# EAGLE design Shunt_Amp_Meter (EAGLE 9.4.2)
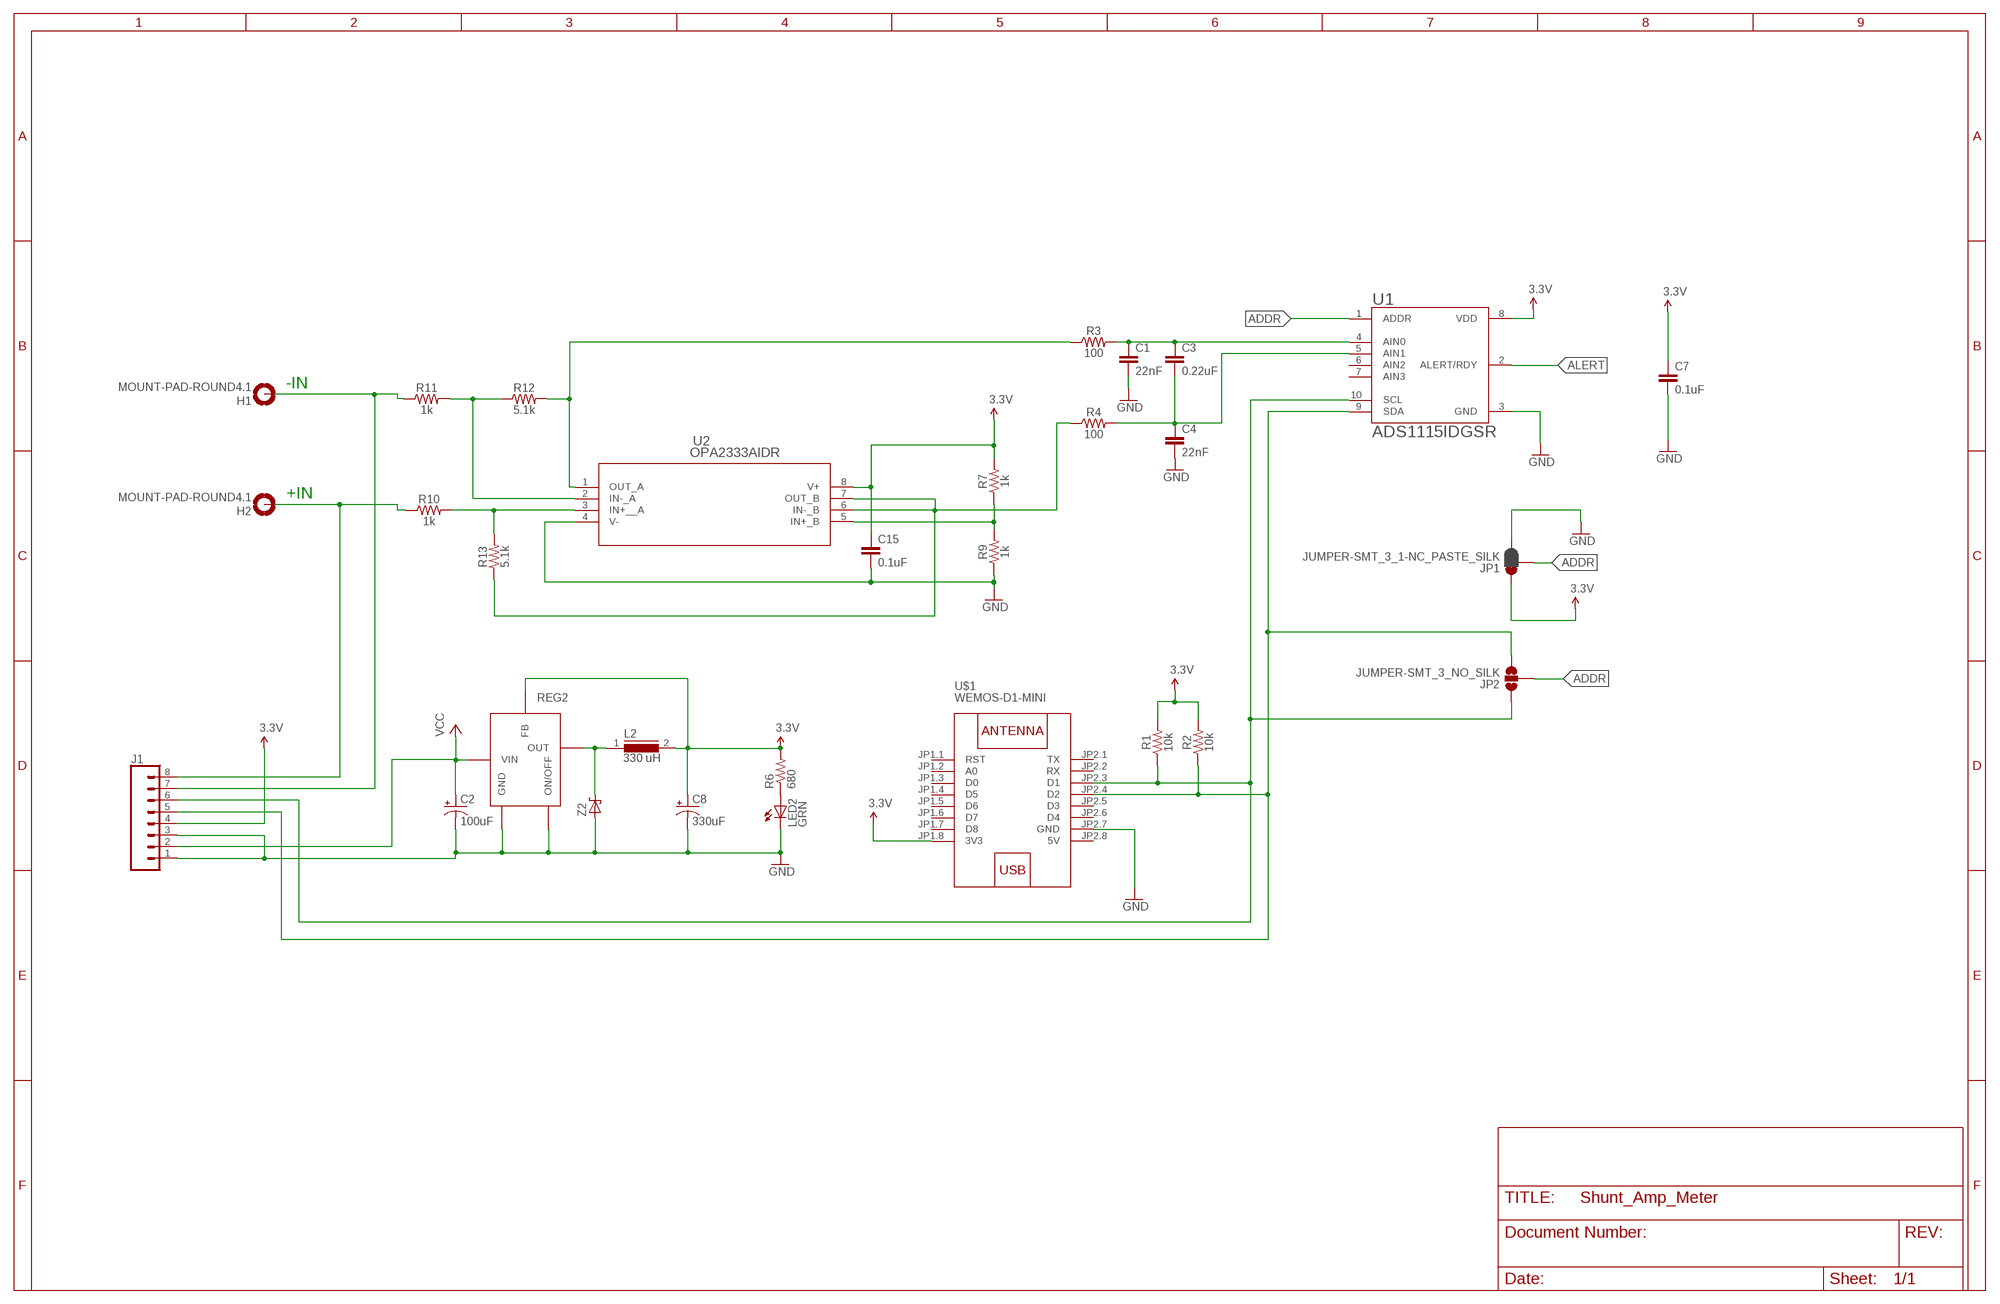
[diagram p0: schematic, sheet 1]

## Parts
C1  22nF  22NF/22,000PF-0603-50V-10%  [0603]
C2  100uF  CAP_POLF  [F_CAP]
C3  0.22uF  0.22UF-0603-25V-10%  [0603]
C4  22nF  22NF/22,000PF-0603-50V-10%  [0603]
C7  0.1uF  0.1UF-0603-25V-5%  [0603]
C8  330uF  CAP_POLF  [F_CAP]
C15  0.1uF  0.1UF-0603-25V-(+80/-20%)  [0603]
H1  MOUNT-PAD-ROUND4.1  [4,1-PAD]
H2  MOUNT-PAD-ROUND4.1  [4,1-PAD]
J1  CONN_08"  [1X08]
JP1  JUMPER-SMT_3_1-NC_PASTE_SILK  [SMT-JUMPER_3_1-NC_PASTE_SILK]
JP2  JUMPER-SMT_3_NO_SILK  [SMT-JUMPER_3_NO_SILK]
L2  330 uH  DR125  [DR125]
LED2  GRN  LED0603  [0603_LED]
R1  10k  10KOHM-0603-1/10W-1%  [0603]
R2  10k  10KOHM-0603-1/10W-1%  [0603]
R3  100  100OHM-0603-1/4W-5%  [0603]
R4  100  100OHM-0603-1/4W-5%  [0603]
R6  680  RESISTOR0603  [0603_RESISTOR]
R7  1k  1KOHM-0603-1/10W-1%  [0603]
R9  1k  1KOHM-0603-1/10W-1%  [0603]
R10  1k  1KOHM-0603-1/10W-1%  [0603]
R11  1k  1KOHM-0603-1/10W-1%  [0603]
R12  5.1k  RESISTOR0603  [0603]
R13  5.1k  RESISTOR0603  [0603]
REG2  TL2575  [TO-263-6]
U1  ADS1115IDGSR  [SOP50P490X110-10N]
U2  OPA2333AIDR  [D8]
U$1  WEMOS-D1-MINI  [WEMOS-D1-MINI]
Z2  SCHOTTKY_DIODE  [SMD_DIODE]

## Nets
3.3V: C7.1 C8.+ C15.1 J1.4 JP1.1 L2.2 R1.2 R2.2 R6.2 R7.2 REG2.4(FB) U1.8(VDD) U2.8(V+) U$1.JP1.8(3V3)
ADDR: JP1.2 JP2.2 U1.1(ADDR)
ALERT: U1.2(ALERT/RDY)
GND: C1.2 C2.- C4.2 C7.2 C8.- C15.2 J1.1 J1.3 JP1.3 LED2.C R9.1 REG2.3(GND) REG2.5(ON/OFF) U1.3(GND) U2.4(V-) U$1.JP2.7(GND) Z2.A
N$1: C1.1 C3.1 R3.2 U1.4(AIN0)
N$2: C3.2 C4.1 R4.2 U1.5(AIN1)
N$3: J1.6 JP2.1 R1.1 U1.10(SCL) U$1.JP2.3(D1)
N$4: J1.5 JP2.3 R2.1 U1.9(SDA) U$1.JP2.4(D2)
N$5: H1.B4,1(MOUNT) J1.7 R11.1
N$7: H2.B4,1(MOUNT) J1.8 R10.1
N$10: R7.1 R9.2 U2.5(IN+_B)
N$11: L2.1 REG2.2(OUT) Z2.C
N$12: LED2.A R6.1
N$13: R10.2 R13.2 U2.3(IN+__A)
N$14: R4.1 R13.1 U2.6(IN-_B) U2.7(OUT_B)
N$16: R11.2 R12.1 U2.2(IN-_A)
N$17: R3.1 R12.2 U2.1(OUT_A)
VCC: C2.+ J1.2 REG2.1(VIN)
Unconnected: U1.6(AIN2) U1.7(AIN3) U$1.JP1.1(RST) U$1.JP1.2(A0) U$1.JP1.3(D0) U$1.JP1.4(D5) U$1.JP1.5(D6) U$1.JP1.6(D7) U$1.JP1.7(D8) U$1.JP2.1(TX) U$1.JP2.2(RX) U$1.JP2.5(D3) U$1.JP2.6(D4)

## Notes on the sheet
- -IN
- +IN

## Power pins joined to a net without a drawn wire
5V: U$1.JP2.8(5V)

## Library data of the parts
C1 C4 = SparkFun-Capacitors:22NF/22,000PF: 0.022uF/22nF/22,000pF ceramic capacitors A capacitor is a passive two-terminal electrical component used to store electrical energy temporarily in an electric field.; PROD_ID: CAP-07885
C2 = jkf:CAP_POL; DIGIKEY#: PCE3917CT-ND
C3 = SparkFun-Capacitors:0.22UF: 0.22µF ceramic capacitors A capacitor is a passive two-terminal electrical component used to store electrical energy temporarily in an electric field.; PROD_ID: CAP-07822
C7 = SparkFun-Capacitors:0.1UF: 0.1µF ceramic capacitors A capacitor is a passive two-terminal electrical component used to store electrical energy temporarily in an electric field.; PROD_ID: CAP-08604
C8 = jkf:CAP_POL; DIGIKEY#: PCE3401CT-ND
C15 = SparkFun-Capacitors:0.1UF: 0.1µF ceramic capacitors A capacitor is a passive two-terminal electrical component used to store electrical energy temporarily in an electric field.; PROD_ID: CAP-00810
H1 H2 = holes:MOUNT-PAD-ROUND: MOUNTING PAD, round
J1 = SparkFun-Connectors:CONN_08: Multi connection point. Often used as Generic Header-pin footprint for 0.1 inch spaced/style header connections On any of the 0.1 inch spaced packages, you can populate with these: Break Away Headers - Straight <https://www.sparkfun.com/products/116> (PRT-00116) Break Away Male Headers - Right Angle <https://www.sparkfun.com/products/553> (PRT-00553) Female Headers <https://www.sparkfun.com/products/115> (PRT-00115) Break Away Headers - Machine Pin <https://www.sparkfun.com/products/117> (PRT-00117) Break Away Female Headers - Swiss Machine Pin <https://www.sparkfun.com/products/743> (PRT-00743) Arduino Stackable Header - 8 Pin <https://www.sparkfun.com/products/9279> (PRT-09279) For SCREWTERMINALS and SPRING TERMINALS visit here: Screw Terimnals on SparkFun.com <https://www.sparkfun.com/search/results?term=Screw+Terminals> (5mm/3.5mm/2.54mm spacing) This device is also useful as a general connection point to wire up your design to another part of your project. Our various solder wires solder well into these plated through hole pads. Hook-Up Wire - Assortment (Stranded, 22 AWG) <https://www.sparkfun.com/products/11375> (PRT-11375) Hook-Up Wire - Assortment (Solid Core, 22 AWG) <https://www.sparkfun.com/products/11367> (PRT-11367) View the entire wire category on our website here <https://www.sparkfun.com/categories/141> Special notes: Molex polarized connector foot print use with SKU : PRT-08231 with associated crimp pins and housings. 1MM SMD Version SKU: PRT-10208 NOTES ON THE VARIANTS LOCK and LOCK_LONGPADS... This footprint was designed to help hold the alignment of a through-hole component (i.e. 6-pin header) while soldering it into place. You may notice that each hole has been shifted either up or down by 0.005 of an inch from it's more standard position (which is a perfectly straight line). This slight alteration caused the pins (the squares in the middle) to touch the edges of the holes. Because they are alternating, it causes a "brace" to hold the component in place. 0.005 has proven to be the perfect amount of "off-center" position when using our standard breakaway headers. Although looks a little odd when you look at the bare footprint, once you have a header in there, the alteration is very hard to notice. Also,if you push a header all the way into place, it is covered up entirely on the bottom side.; PROD_ID: CONN-08438
JP1 = SparkFun-Jumpers:JUMPER-SMT_3_1-NC_PASTE: Normally closed solder jumper (1 of 2 connections) This jumper has an aperture in the stencil to allow solder paste to bridge one of the two connections. One connection is normally closed (NC), while the other is normally open (NO). Wick off the solder to open the connection. Reapply solder to reclose the connection. Apply solder to the other side instead to change the current path.
JP2 = SparkFun-Jumpers:JUMPER-SMT_3_NO: Normally open jumper This jumper has three pads in close proximity to each other. Apply solder to close the connection(s).
L2 = jkf:DR125; DIGIKEY#: SRR1208-102KLCT-ND
LED2 = jkf:LED; DIGIKEY#: 516-2493-1-ND; MANF: Avago Technologies; MANF#: HSMG-C191
R1 R2 = SparkFun-Resistors:10KOHM: 10kΩ resistor A resistor is a passive two-terminal electrical component that implements electrical resistance as a circuit element. Resistors act to reduce current flow, and, at the same time, act to lower voltage levels within circuits. - Wikipedia; PROD_ID: RES-00824
R3 R4 = SparkFun-Resistors:100OHM: 100Ω resistor A resistor is a passive two-terminal electrical component that implements electrical resistance as a circuit element. Resistors act to reduce current flow, and, at the same time, act to lower voltage levels within circuits. - Wikipedia; PROD_ID: RES-12438
R6 = jkf:RESISTOR; DIGIKEY#: P680GCT-ND
R7 R9-R11 = SparkFun-Resistors:1KOHM: 1kΩ resistor A resistor is a passive two-terminal electrical component that implements electrical resistance as a circuit element. Resistors act to reduce current flow, and, at the same time, act to lower voltage levels within circuits. - Wikipedia; PROD_ID: RES-07856
R12 R13 = SparkFun-Resistors:RESISTOR: Generic Resistor Package
REG2 = jkf:TL2575; DIGIKEY#: 296-21828-1-ND; MANF: Texas Instruments; MANF#: TL2575-33IKTTR
U1 = ADS1115IDGSR:ADS1115IDGSR: 16-Bit ADC with Integrated MUX, PGA, Comparator, Oscillator, and Reference 10-VSSOP -40 to 125; DESCRIPTION: 16-Bit ADC with Integrated MUX, PGA, Comparator, Oscillator, and Reference 10-VSSOP -40 to 125; DIGI-KEY_PART_NUMBER: 296-38849-1-ND; DIGI-KEY_PURCHASE_URL: https://www.digikey.com/product-detail/en/texas-instruments/ADS1115IDGSR/296-38849-1-ND/5142969?utm_source=snapeda&utm_medium=aggregator&utm_campaign=symbol; MF: Texas Instruments; MP: ADS1115IDGSR; PACKAGE: MSOP-10 Texas Instruments
U2 = OPA2333AIDR:OPA2333AIDR; MANUFACTURER_PART_NUMBER: OPA2333AIDR; VENDOR: Texas Instruments
U$1 = diy-modules:WEMOS-D1-MINI: WEMOS D1 mini: Mini Wi-Fi Board based on ESP-8266 device More details can be found here: https://www.wemos.cc/product/d1-mini.html Click here to find device on ebay.com <http://www.ebay.com/sch/wemos+d1+mini+nodemcu>
Z2 = jkf:SCHOTTKY_DIODE; DIGIKEY#: 1N5819HW-FDICT-ND; MANF: Diodes Inc; MANF#: 1N5819HW-7-F

## Board
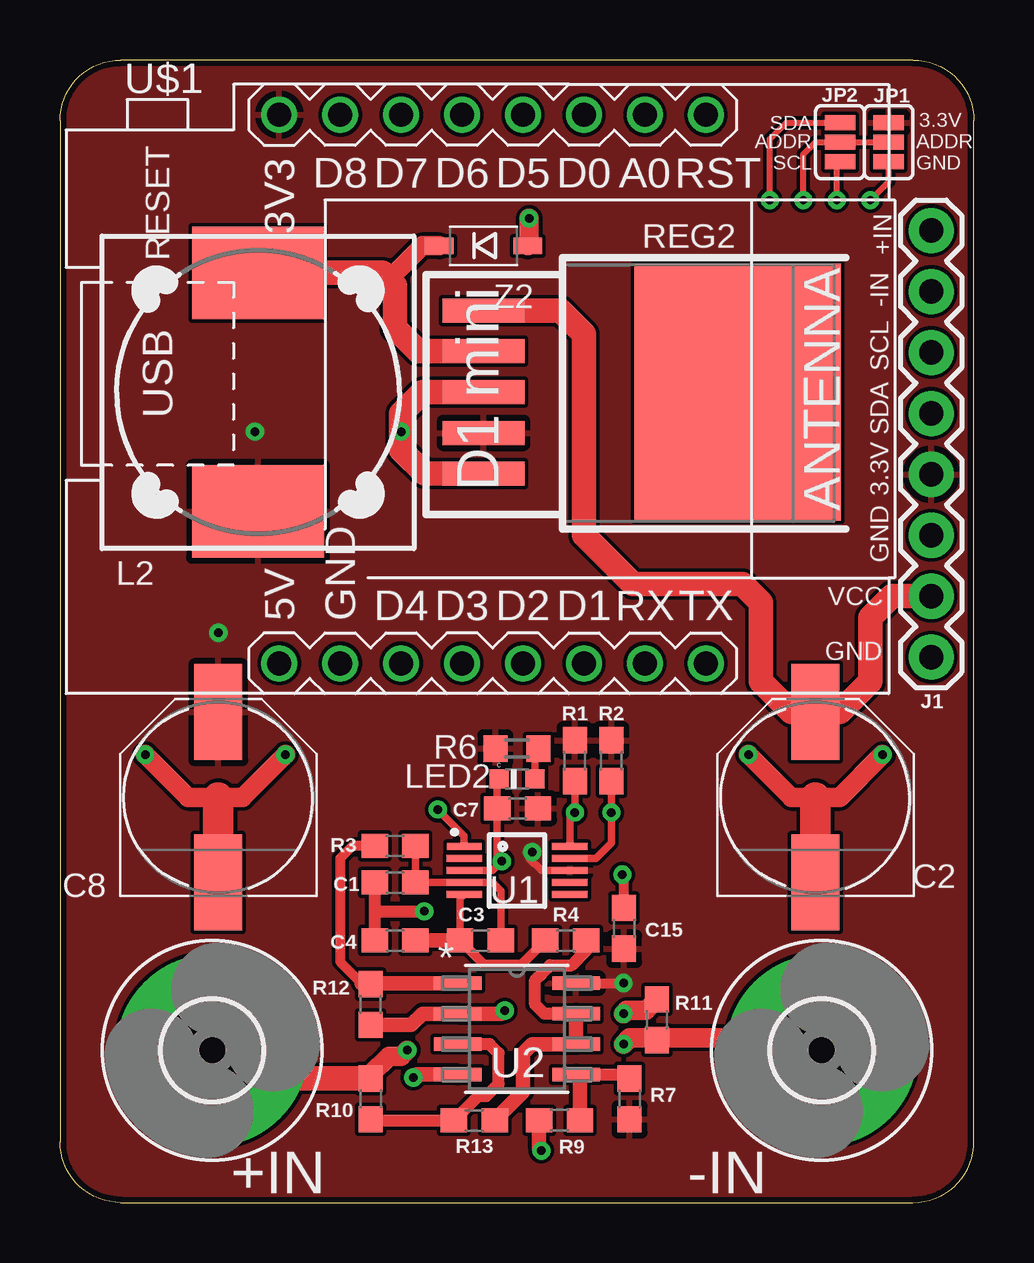
[diagram p1: board, top side]
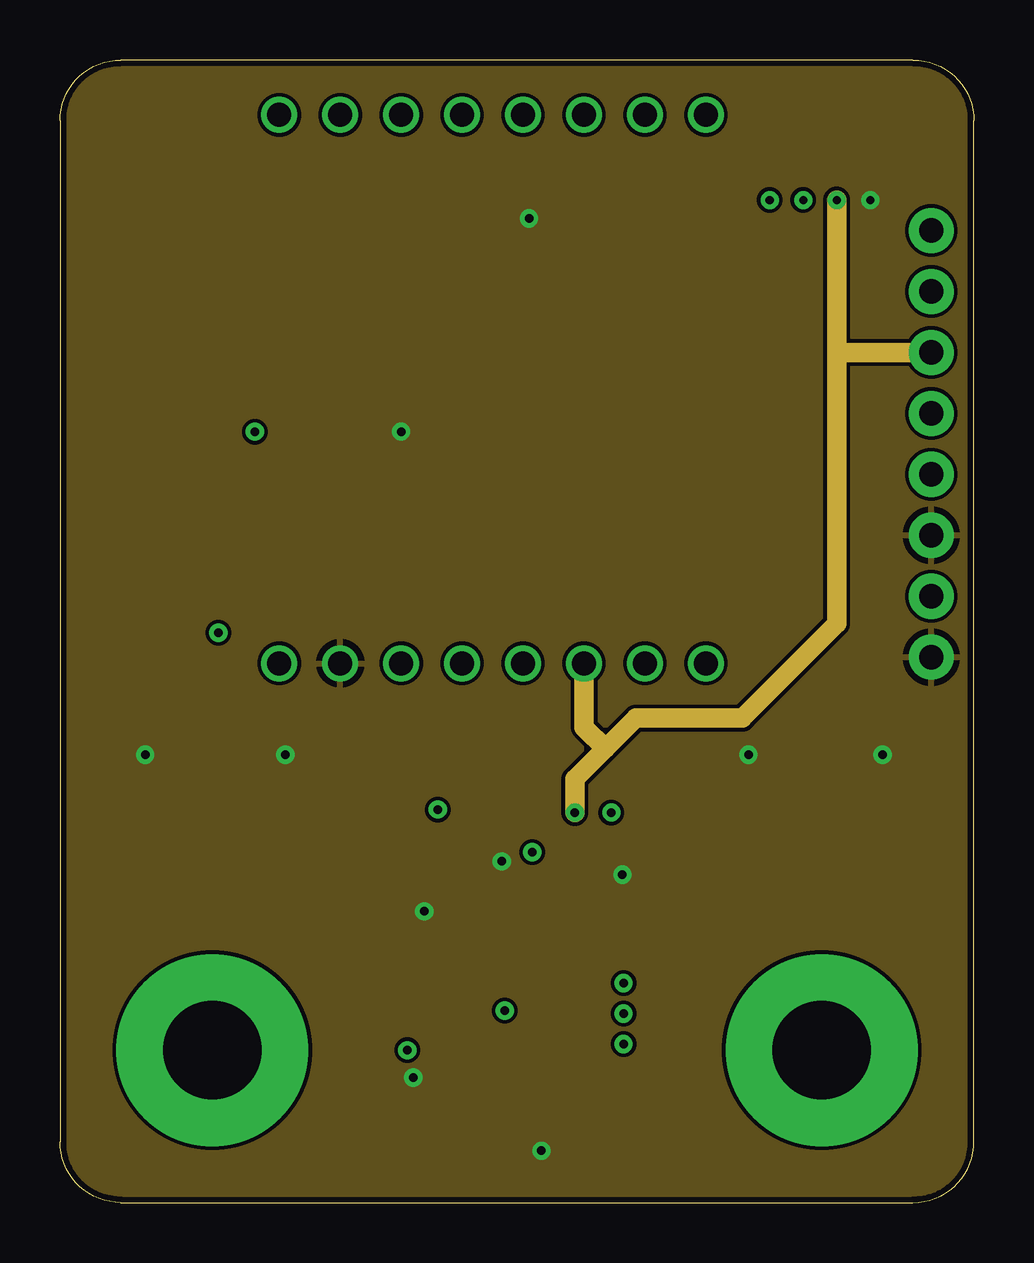
[diagram p2: board, inner layer Route2]
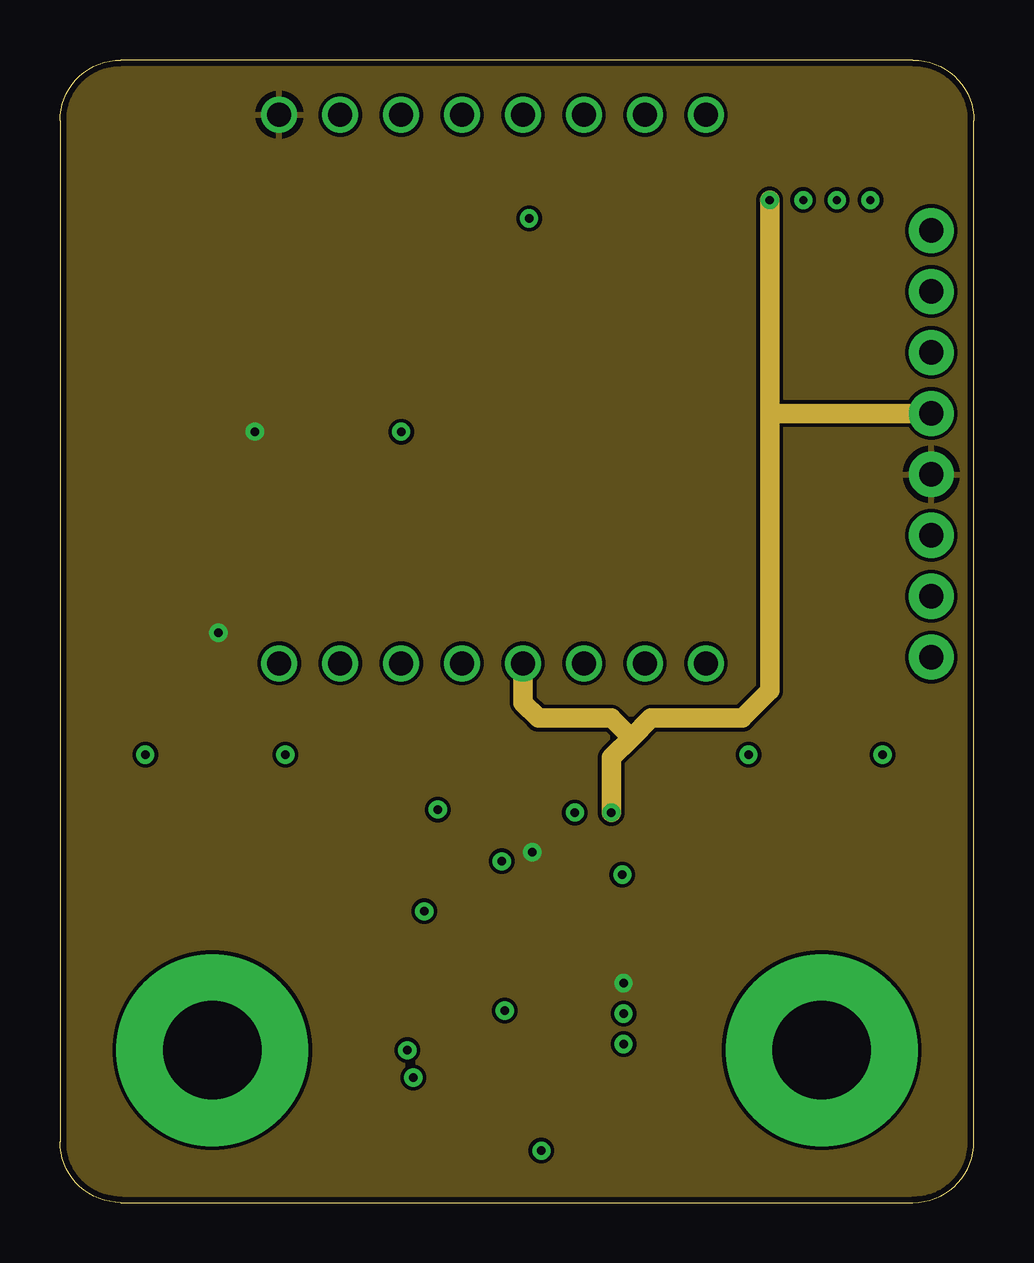
[diagram p3: board, inner layer Route15]
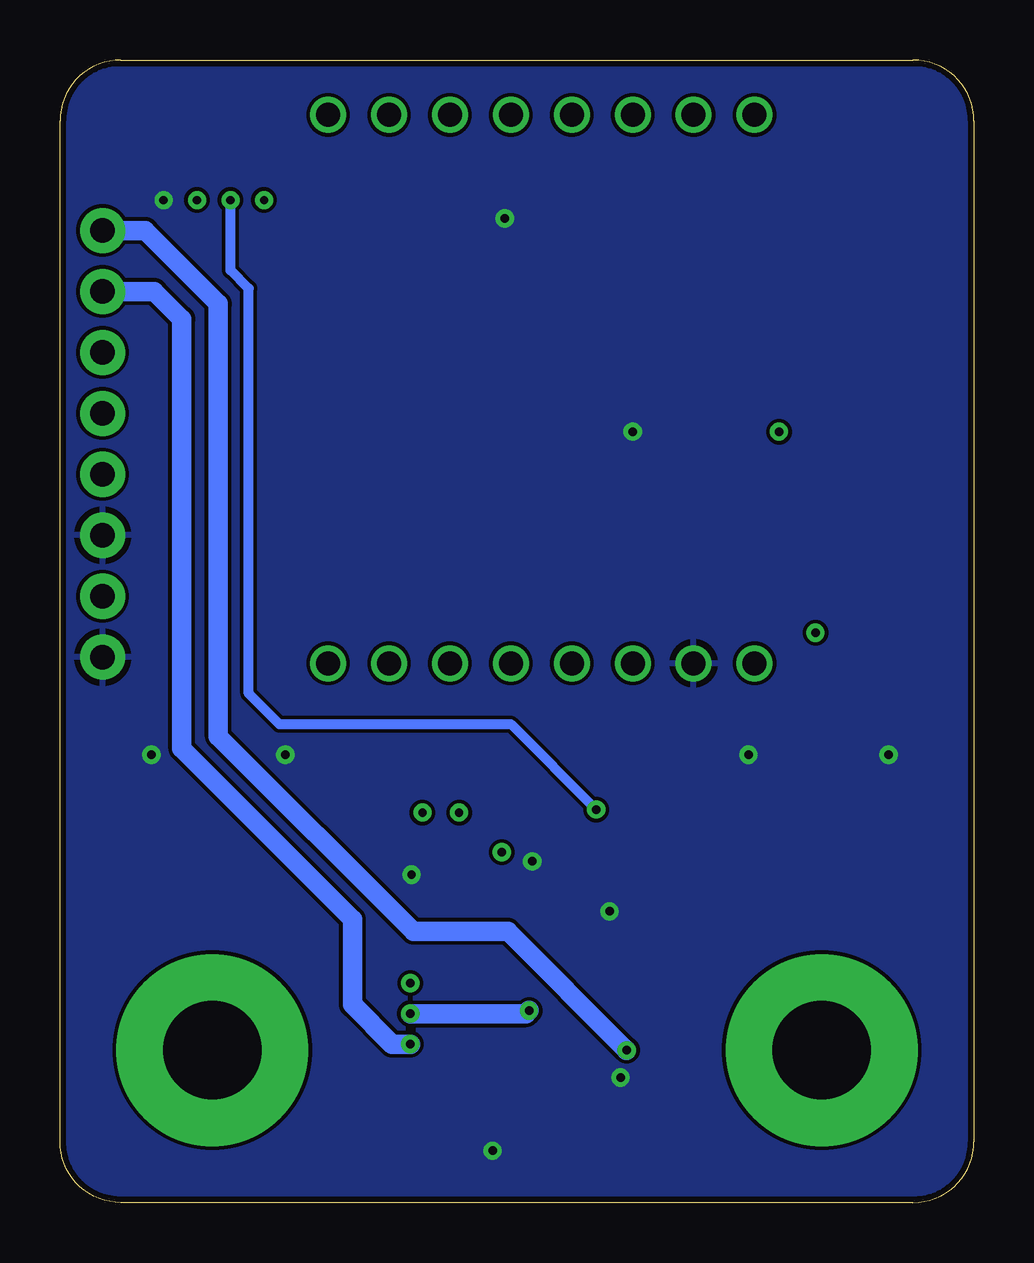
[diagram p4: board, bottom side, seen from below]

Size 38.1 x 47.62 mm. Coordinates in mm from the lower left corner, seen from the top.
Outline: 2.54,0 35.56,0 arc90 38.1,2.54 38.1,45.09 arc90 35.56,47.62 2.54,47.62 arc90 0,45.09 0,2.54 arc90 2.54,0
Copper layers (1+2*15+16): Top 0.0178mm / dielectric 12mil / Route2 0.0356mm / dielectric 28mil / Route15 0.0356mm / dielectric 12mil / Bottom 0.0178mm
Design rules "SSC-EAGLE-4Lyr_v1.0.0.3 *": minimum track width 6mil, minimum drill 8mil, track to track 6mil, track to pad 6mil, pad to pad 6mil, via to via 6mil, smd to smd 6mil, copper to edge 10mil, drill to drill 16mil, minimum pad ring 8mil, minimum via ring 8mil, stop-mask expansion 3mil, vias tented up to drill 0mil, thermal gap 10mil

### Footprints (pad centres in the part's own frame; a part is rotated, then mirrored left to right if it is on the bottom)
0603 = smd 1.1 x 1: 1 -0.85,0; 2 0.85,0
F_CAP = smd 4 x 2: + 3.55,0; - -3.55,0
4,1-PAD = drill 4.1 pad 8: B4,1 0,0
1X08 = drill 1.016 pad 1.88: 1 0,0; 2 2.54,0; 3 5.08,0; 4 7.62,0; 5 10.16,0; 6 12.7,0; 7 15.24,0; 8 17.78,0
SMT-JUMPER_3_1-NC_PASTE_SILK = smd 0.635 x 1.27: 1 -0.813,0; 2 0,0; 3 0.813,0
SMT-JUMPER_3_NO_SILK = smd 0.635 x 1.27: 1 -0.813,0; 2 0,0; 3 0.813,0
DR125 = smd 3.85 x 5.5: 1 -4.975,0; 2 4.975,0
0603_LED = smd 0.8 x 0.8: A -0.75,0; C 0.75,0
0603_RESISTOR = smd 1 x 1.1: 1 -0.9,0; 2 0.9,0
TO-263-6 = smd 1 x 3.4: 1 -3.4,-6.6; 2 -1.7,-6.6; 3 0,-6.6; 4 1.7,-6.6; 5 3.4,-6.6 | smd 10.7 x 8.6: P$1 0,4
SOP50P490X110-10N = smd 1.45 x 0.3: 1 -2.2,1 | smd 1.47 x 0.3: 2 -2.2,0.5; 3 -2.2,0; 4 -2.2,-0.5; 5 -2.2,-1; 6 2.2,-1; 7 2.2,-0.5; 8 2.2,0; 9 2.2,0.5; 10 2.2,1
D8 = smd 1.981 x 0.559: 1 -2.464,1.905; 2 -2.464,0.635; 3 -2.464,-0.635; 4 -2.464,-1.905; 5 2.464,-1.905; 6 2.464,-0.635; 7 2.464,0.635; 8 2.464,1.905
WEMOS-D1-MINI = drill 1: JP1.1 -11.43,9.525; JP1.2 -11.43,6.985; JP1.3 -11.43,4.445; JP1.4 -11.43,1.905; JP1.5 -11.43,-0.635; JP1.6 -11.43,-3.175; JP1.7 -11.43,-5.715; JP1.8 -11.43,-8.255; JP2.1 11.43,9.525; JP2.2 11.43,6.985; JP2.3 11.43,4.445; JP2.4 11.43,1.905; JP2.5 11.43,-0.635; JP2.6 11.43,-3.175; JP2.7 11.43,-5.715; JP2.8 11.43,-8.255
SMD_DIODE = smd 1.2 x 0.7: A -1.85,0; C 1.85,0

### Placement (x,y rotation side)
C1  13.97,13.34 180 top
C2  31.5,16.89 90 top
C3  17.53,10.92 180 top
C4  13.97,10.92 180 top
C7  19.08,16.43 180 top
C8  6.6,16.89 90 top
C15  23.52,11.43 90 top
H1  31.75,6.35 0 top
H2  6.35,6.35 0 top
J1  36.32,22.73 90 top
JP1  34.54,44.2 270 top
JP2  32.51,44.2 90 top
L2  8.25,33.78 270 top
LED2  19.05,17.65 180 top
R1  21.46,18.41 90 top
R2  22.99,18.41 90 top
R3  13.97,14.86 0 top
R4  21.08,10.92 180 top
R6  19.05,18.92 180 top
R7  23.75,4.32 270 top
R9  20.83,3.43 0 top
R10  12.95,4.32 270 top
R11  24.89,7.62 90 top
R12  12.95,8.26 90 top
R13  17.27,3.43 180 top
REG2  24.26,33.78 270 top
U1  19.05,13.84 0 top
U2  19.05,7.24 0 top
U$1  17.4,33.91 270 top
Z2  17.65,39.88 180 top

### Tracks (layer width: path | path; a pad name or v marks a point on that pad's centre or on a via)
3.3V  (via drill 0.35)
  Top 0.305: U1.8 20.07,13.84 19.56,14.35
  Top 0.406: U2.8 v23.5,9.14
  other vias: 19.68,14.61 8.13,32.13 6.6,23.75
  pour Top: 0,0 0,47.62 38.1,47.62 38.1,0
  pour Route15: 0,0 0,47.62 38.1,47.62 38.1,0
ADDR  (via drill 0.35)
  Top 0.254: v30.99,41.78 30.99,43.69 31.5,44.2 JP2.2 JP1.2
  Top 0.305: U1.1 16.85,15.28 v15.75,16.38
  Bottom 0.406: v30.99,41.78 30.99,38.86 30.23,38.1 30.23,21.21 28.96,19.94 19.3,19.94 v15.75,16.38
GND  (via drill 0.35)
  Top 0.254: v33.78,41.78 34.54,42.55 JP1.3
  Top 0.305: U1.3 18.03,13.84 v18.41,14.22 18.23,14.41 C7.2 18.23,17.58 LED2.C
  Top 0.406: C15.2 23.52,13.59 v23.44,13.67
  Top 0.508: C1.2 13.12,12.32 | 13.12,12.32 C4.2 | 13.12,12.32 13.3,12.14 v15.19,12.14
  Top 0.61: U2.4 14.86,5.33 v14.73,5.21 | v20.07,2.16 19.98,2.25 R9.1
  Top 0.813: v28.7,18.67 30.48,16.89 31.5,16.89 32.51,16.89 v34.29,18.67 | v19.56,41.02 19.56,39.93 Z2.A | v9.4,18.67 7.62,16.89 6.6,16.89 5.33,16.89 v3.56,18.67
  Top 1.016: REG2.3 15.11,33.78 14.22,32.89 v14.22,32.13 14.22,31.37 15.21,30.38 REG2.5
  Top 1.27: 31.5,16.89 C2.- | 6.6,16.89 C8.-
  pour Route2: 0,0 0,47.62 38.1,47.62 38.1,0
  pour Bottom: 0,0 0,47.62 38.1,47.62 38.1,0
N$1
  Top 0.305: C3.1 18.38,12.99 18.03,13.34 U1.4 16.01,13.34 16,13.34 C1.1 R3.2
N$2
  Top 0.305: C3.2 16.68,12.67 U1.5
  Top 0.406: R4.2 19.22,9.91 17.69,9.91 C3.2
  Top 0.61: C3.2 C4.1
N$3  (via drill 0.35)
  Top 0.254: v32.39,41.78 32.39,43.26 JP2.1
  Top 0.305: U1.10 21.25,16.04 v21.46,16.26 R1.1
  Route2 0.813: v21.46,16.26 21.46,17.65 22.73,18.92 | 32.39,35.43 32.39,24.13 28.45,20.19 24,20.19 22.73,18.92 | 32.39,35.43 v32.39,41.78 | 22.73,18.92 21.84,19.81 U$1.JP2.3 | J1.6 32.39,35.43
N$4  (via drill 0.35)
  Top 0.254: v29.59,41.78 29.59,44.32 30.28,45.01 JP2.3
  Top 0.305: U1.9 22.35,14.35 22.99,14.99 v22.99,16.26 R2.1
  Route15 0.813: v22.99,16.26 22.99,18.54 23.81,19.37 | 23.81,19.37 24.64,20.19 28.45,20.19 29.59,21.34 29.59,32.89 | 29.59,32.89 v29.59,41.78 | U$1.JP2.4 19.3,20.83 19.94,20.19 22.99,20.19 23.81,19.37 | J1.5 29.59,32.89
N$5  (via drill 0.35)
  Top 0.813: 24.8,6.86 R11.1 | v23.5,6.6 23.75,6.86 24.8,6.86 | H1.B4,1 31.24,6.86 24.8,6.86
  Bottom 0.813: v23.5,6.6 24.26,6.6 25.91,8.26 25.91,11.81 33.02,18.92 33.02,36.83 34.16,37.97 J1.7
N$7  (via drill 0.35)
  Top 0.813: v14.48,6.35 14.22,6.1 13.72,6.1 12.95,5.33 R10.1
  Top 1.016: R10.1 7.53,5.17 H2.B4,1
  Bottom 0.813: v14.48,6.35 19.43,11.3 23.37,11.3 31.5,19.43 31.5,37.46 34.54,40.51 J1.8
N$10
  Top 0.508: U2.5 23.58,5.33 R7.1
  Top 0.61: R9.2 21.68,5.17 U2.5
N$11
  Top 0.813: Z2.C 15.11,39.88 13.72,38.48
  Top 1.016: REG2.2 14.94,35.48 13.97,36.45 13.97,38.23 13.72,38.48 13.44,38.76 L2.1
N$12
  Top 0.305: LED2.A 19.8,18.77 R6.1
N$13
  Top 0.508: R10.2 12.99,3.43 R13.2 17.44,4.44 17.78,4.44 18.29,4.95 18.29,6.22 17.91,6.6 U2.3
N$14
  Top 0.508: U2.7 20.19,7.87 19.81,8.26 19.81,9.27 20.12,9.58 20.12,9.59 20.42,9.89 21.34,9.89 21.93,10.49 R4.1
  Top 0.61: U2.7 U2.6 19.68,6.6 19.3,6.22 19.3,4.61 R13.1
N$16  (via drill 0.35)
  Top 0.61: R12.1 14.64,7.41 15.11,7.87 U2.2 18.41,7.87 v18.54,8
  Top 0.813: v23.5,7.87 23.62,8 24.42,8 R11.2
  Bottom 0.813: v23.5,7.87 18.67,7.87 v18.54,8
N$17
  Top 0.406: R3.1 12.19,14.86 11.68,14.35 11.68,10.03 12.57,9.14 12.99,9.14
  Top 0.61: 12.99,9.14 R12.2 | U2.1 12.57,9.14
VCC
  Top 1.016: REG2.1 20.86,37.18 21.84,36.2 21.84,27.81 23.88,25.78 28.45,25.78 29.21,25.02 29.21,21.72 30.49,20.44 C2.+ 32.51,20.44 33.78,21.72 33.78,24.38 34.67,25.27 J1.2

### Text on the board
tNames: SDA | 3.3V | ADDR | ADDR | SCL | GND | +IN | -IN | SCL | SDA | 3.3V | GND | VCC | GND | +IN | -IN